# EAGLE design VentilationSystem (EAGLE 7.5.0)
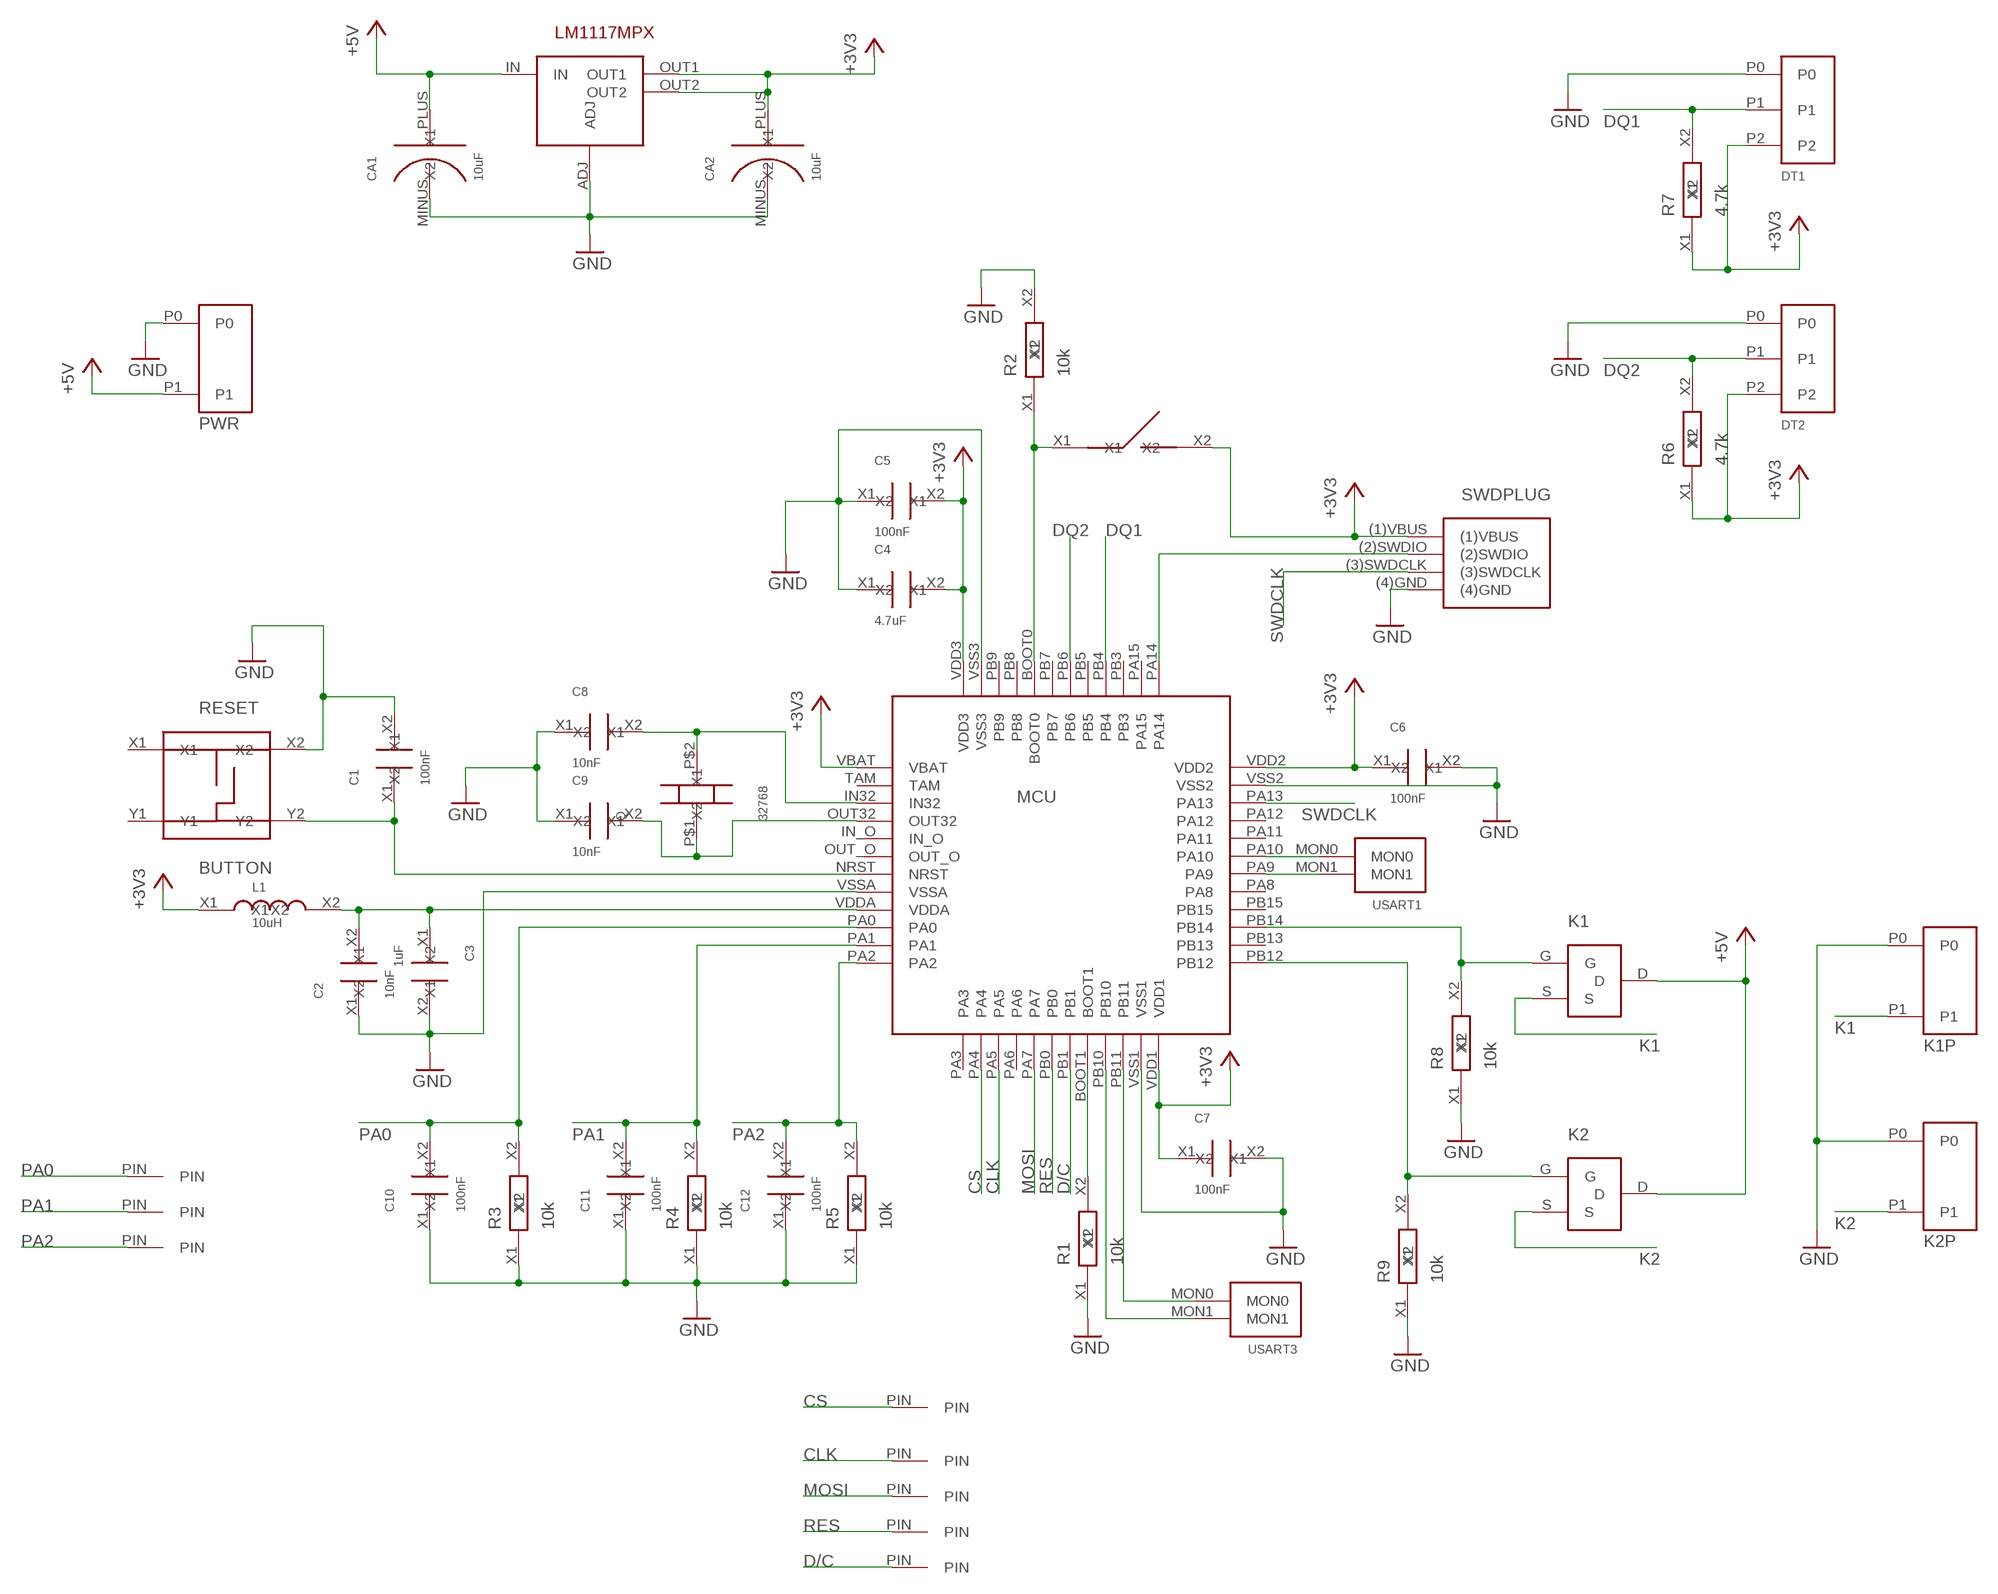
[diagram p0: schematic, sheet 1]

## Parts
C1  100nF  C_SMD_2.1X1.25  [SMD_2.1X1.25]
C2  10nF  C_SMD_2.1X1.25  [SMD_2.1X1.25]
C3  1uF  C_SMD_2.1X1.25  [SMD_2.1X1.25]
C4  4.7uF  C_SMD_2.1X1.25  [SMD_2.1X1.25]
C5  100nF  C_SMD_2.1X1.25  [SMD_2.1X1.25]
C6  100nF  C_SMD_2.1X1.25  [SMD_2.1X1.25]
C7  100nF  C_SMD_2.1X1.25  [SMD_2.1X1.25]
C8  10nF  C_SMD_2.1X1.25  [SMD_2.1X1.25]
C9  10nF  C_SMD_2.1X1.25  [SMD_2.1X1.25]
C10  100nF  C_SMD_2.1X1.25  [SMD_2.1X1.25]
C11  100nF  C_SMD_2.1X1.25  [SMD_2.1X1.25]
C12  100nF  C_SMD_2.1X1.25  [SMD_2.1X1.25]
CA1  10uF  C_SMD_TA_A  [C_SMD_TA_A]
CA2  10uF  C_SMD_TA_A  [C_SMD_TA_A]
CLKPIN  PIN_1  [PIN_1]
CSPIN  PIN_1  [PIN_1]
D/CPIN  PIN_1  [PIN_1]
DT1  RAIL_3  [RAIL_3]
DT2  RAIL_3  [RAIL_3]
K1  IRFML8244TRPBF  [IRFML8244TRPBF]
K1P  RAIL_2  [RAIL_2]
K2  IRFML8244TRPBF  [IRFML8244TRPBF]
K2P  RAIL_2  [RAIL_2]
L1  10uH  L_SMD_2.1X1.25  [SMD_2.1X1.25]
MCU  STM32F103CBT6  [STM32F103CBT6]
MOSIPIN  PIN_1  [PIN_1]
PA0PIN  PIN_1  [PIN_1]
PA1PIN  PIN_1  [PIN_1]
PA2PIN  PIN_1  [PIN_1]
PWR  RAIL_2  [RAIL_2]
Q  32768  QUARTZ_CYL  [QUARTZ_CYL]
R1  10k  R_SMD_2.1X1.25  [SMD_2.1X1.25]
R2  10k  R_SMD_2.1X1.25  [SMD_2.1X1.25]
R3  10k  R_SMD_2.1X1.25  [SMD_2.1X1.25]
R4  10k  R_SMD_2.1X1.25  [SMD_2.1X1.25]
R5  10k  R_SMD_2.1X1.25  [SMD_2.1X1.25]
R6  4.7k  R_SMD_2.1X1.25  [SMD_2.1X1.25]
R7  4.7k  R_SMD_2.1X1.25  [SMD_2.1X1.25]
R8  10k  R_SMD_2.1X1.25  [SMD_2.1X1.25]
R9  10k  R_SMD_2.1X1.25  [SMD_2.1X1.25]
RESET  BUTTON  [BUTTON]
RESPIN  PIN_1  [PIN_1]
SWDPLUG  SWD  [SWD]
U$3  DIP_1  [DIP_1]
U$4  LM1117MPX-ADJ  [LM1117MPX-ADJ]
USART1  MON2PIN  [MON2PIN]
USART3  MON2PIN  [MON2PIN]

## Nets
+3V3: C4.X2 C5.X2 C6.X1 C7.X1 CA2.PLUS(X2) DT1.P2 DT2.P2 L1.X1 MCU.VBAT MCU.VDD1 MCU.VDD2 MCU.VDD3 R6.X1 R7.X1 SWDPLUG.(1)VBUS U$3.X2 U$4.OUT1 U$4.OUT2
+5V: CA1.PLUS(X2) K1.D K2.D PWR.P1 U$4.IN
CLK: CLKPIN.PIN MCU.PA5
CS: CSPIN.PIN MCU.PA4
D/C: D/CPIN.PIN MCU.PB1
DQ1: DT1.P1 MCU.PB4 R7.X2
DQ2: DT2.P1 MCU.PB6 R6.X2
GND: C1.X2 C2.X1 C3.X2 C4.X1 C5.X1 C6.X2 C7.X2 C8.X1 C9.X1 C10.X1 C11.X1 C12.X1 CA1.MINUS(X1) CA2.MINUS(X1) DT1.P0 DT2.P0 K1P.P0 K2P.P0 MCU.VSS1 MCU.VSS2 MCU.VSS3 MCU.VSSA PWR.P0 R1.X1 R2.X2 R3.X1 R4.X1 R5.X1 R8.X1 R9.X1 RESET.X2 SWDPLUG.(4)GND U$4.ADJ
K1: K1.S K1P.P1
K2: K2.S K2P.P1
MOSI: MCU.PA7 MOSIPIN.PIN
N$1: C2.X2 C3.X1 L1.X2 MCU.VDDA
N$2: MCU.BOOT0 R2.X1 U$3.X1
N$3: MCU.BOOT1 R1.X2
N$4: C1.X1 MCU.NRST RESET.Y2
N$5: MCU.PA10 USART1.MON0
N$6: MCU.PA14 SWDPLUG.(2)SWDIO
N$7: MCU.PA9 USART1.MON1
N$8: C9.X2 MCU.OUT32 Q.P$1(X1)
N$9: C8.X2 MCU.IN32 Q.P$2(X2)
N$10: K1.G MCU.PB14 R8.X2
N$11: K2.G MCU.PB12 R9.X2
N$12: MCU.PB11 USART3.MON0
N$13: MCU.PB10 USART3.MON1
PA0: C10.X2 MCU.PA0 PA0PIN.PIN R3.X2
PA1: C11.X2 MCU.PA1 PA1PIN.PIN R4.X2
PA2: C12.X2 MCU.PA2 PA2PIN.PIN R5.X2
RES: MCU.PB0 RESPIN.PIN
SWDCLK: MCU.PA13 SWDPLUG.(3)SWDCLK
Unconnected: MCU.IN_O MCU.OUT_O MCU.PA3 MCU.PA6 MCU.PA8 MCU.PA11 MCU.PA12 MCU.PA15 MCU.PB3 MCU.PB5 MCU.PB7 MCU.PB8 MCU.PB9 MCU.PB13 MCU.PB15 MCU.TAM RESET.X1 RESET.Y1

## Library data of the parts
C1-C12 = MyPowerComponents:C_SMD_2.1X1.25
CA1 CA2 = MyAmSys:C_SMD_TA_A
CLKPIN CSPIN D/CPIN MOSIPIN PA0PIN PA1PIN PA2PIN RESPIN = My_BLE:PIN_1
DT1 DT2 = My_HV_Components:RAIL_3
K1 K2 = My_STM32:IRFML8244TRPBF
K1P K2P PWR = My_HV_Components:RAIL_2
L1 = MyPowerComponents:L_SMD_2.1X1.25
MCU = My_STM32:STM32F103CBT6
Q = MySTM32F103RGT6:QUARTZ_CYL
R1-R9 = MyPowerComponents:R_SMD_2.1X1.25
RESET = My_STM32:BUTTON
SWDPLUG = MyCMOSsensor:SWD
U$3 = My_STM32L15x:DIP_1
U$4 = My_OPT:LM1117MPX-ADJ
USART1 USART3 = MyCMOSsensor:MON2PIN

## Board
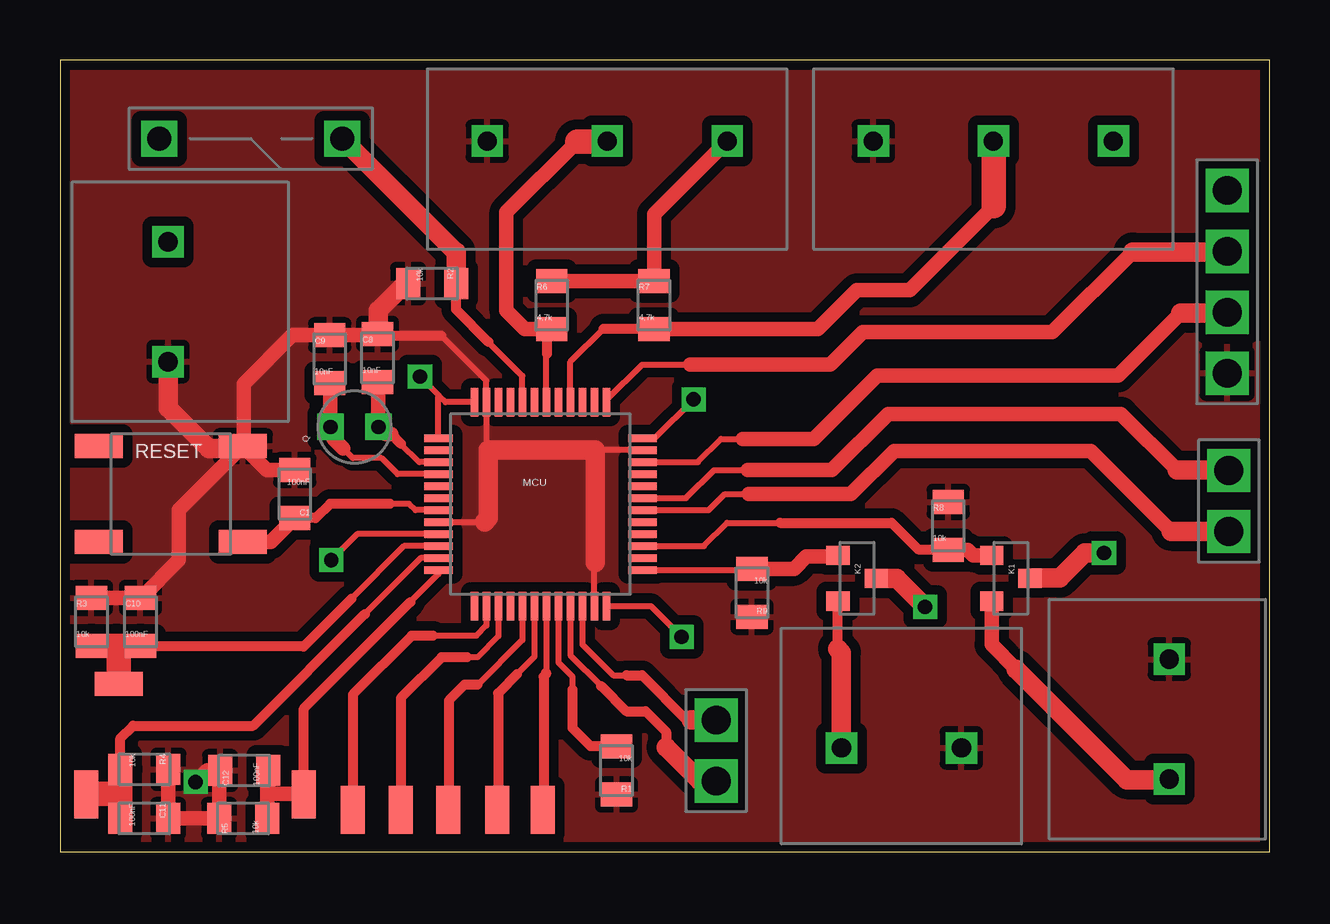
[diagram p1: board, top side]
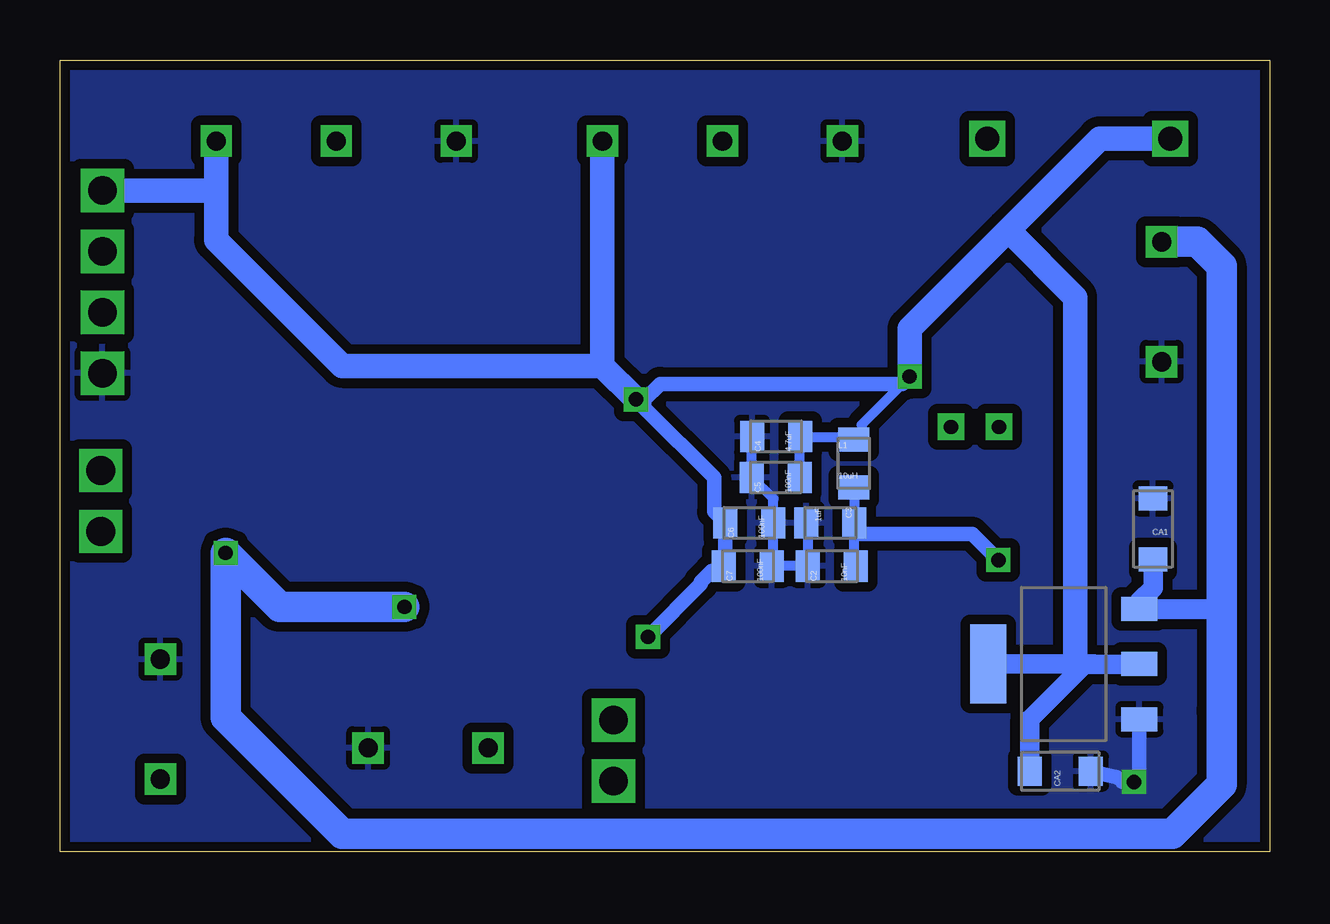
[diagram p2: board, bottom side, seen from below]

Size 50.4 x 33 mm. Coordinates in mm from the lower left corner, seen from the top.
Outline: 0,0 50.4,0 50.4,33 0,33 0,0
Copper layers (1*16): Top 0.035mm / dielectric 1.5mm / Bottom 0.035mm
Design rules "default *": minimum track width 10mil, minimum drill 24mil, track to track 8mil, track to pad 8mil, pad to pad 8mil, via to via 8mil, smd to smd 8mil, copper to edge 10mil, drill to drill 8mil, minimum pad ring 10mil, minimum via ring 8mil, stop-mask expansion 4mil, vias tented up to drill 0mil, thermal gap 10mil

### Footprints (pad centres in the part's own frame; a part is rotated, then mirrored left to right if it is on the bottom)
SMD_2.1X1.25 = smd 1.3 x 1: X1 0,1; X2 0,-1
C_SMD_TA_A = smd 1.2 x 1: MINUS 0,-1.27; PLUS 0,1.27
PIN_1 = smd 2 x 1: PIN 0,0
RAIL_3 = drill 0.8 square: P0 0,5; P1 0,0; P2 0,-5
IRFML8244TRPBF = smd 0.802 x 0.972: D 0,0.8; G -0.95,-0.8; S 0.95,-0.8
RAIL_2 = drill 0.8 square: P0 0,2.5; P1 0,-2.5
STM32F103CBT6 = smd 0.3 x 1.2: BOOT0 -0.75,4.25; BOOT1 0.75,-4.25; PA3 -2.75,-4.25; PA4 -2.25,-4.25; PA5 -1.75,-4.25; PA6 -1.25,-4.25; PA7 -0.75,-4.25; PA14 2.75,4.25; PA15 2.25,4.25; PB0 -0.25,-4.25; PB1 0.25,-4.25; PB3 1.75,4.25; PB4 1.25,4.25; PB5 0.75,4.25; PB6 0.25,4.25; PB7 -0.25,4.25; PB8 -1.25,4.25; PB9 -1.75,4.25; PB10 1.25,-4.25; PB11 1.75,-4.25; VDD1 2.75,-4.25; VDD3 -2.75,4.25; VSS1 2.25,-4.25; VSS3 -2.25,4.25 | smd 1.2 x 0.3: IN32 -4.25,1.75; IN_O -4.25,0.75; NRST -4.25,-0.25; OUT32 -4.25,1.25; OUT_O -4.25,0.25; PA0 -4.25,-1.75; PA1 -4.25,-2.25; PA2 -4.25,-2.75; PA8 4.25,-0.75; PA9 4.25,-0.25; PA10 4.25,0.25; PA11 4.25,0.75; PA12 4.25,1.25; PA13 4.25,1.75; PB12 4.25,-2.75; PB13 4.25,-2.25; PB14 4.25,-1.75; PB15 4.25,-1.25; TAM -4.25,2.25; VBAT -4.25,2.75; VDD2 4.25,2.75; VDDA -4.25,-1.25; VSS2 4.25,2.25; VSSA -4.25,-0.75
QUARTZ_CYL = drill 0.6 square: P$1 0,1; P$2 0,-1
BUTTON = smd 2 x 1: X1 -3,2; X2 3,2; Y1 -3,-2; Y2 3,-2
SWD = drill 1.2 square: (1)VBUS 0,5.08; (2)SWDIO 0,2.54; (3)SWDCLK 0,0; (4)GND 0,-2.54
DIP_1 = drill 1 square: X1 0,2.54; X2 0,-5.08
LM1117MPX-ADJ = smd 1 x 1.5: ADJ -2.3,-6.3; IN 2.3,-6.3; OUT1 0,-6.3 | smd 3.3 x 1.5: OUT2 0,0
MON2PIN = drill 1.2 square: MON0 0,2.54; MON1 0,0

### Placement (x,y rotation side)
C1  9.78,14.9 180 top
C2  18.24,11.9 90 bottom
C3  18.3,13.7 270 bottom
C4  20.56,17.3 90 bottom
C5  20.57,15.6 90 bottom
C6  21.68,13.7 90 bottom
C7  21.74,11.9 90 bottom
C8  13.23,20.58 0 top
C9  11.24,20.53 0 top
C10  3.35,9.58 0 top
C11  3.51,1.38 270 top
C12  7.67,3.38 90 top
CA1  4.86,13.45 180 bottom
CA2  8.72,3.35 90 bottom
CLKPIN  14.2,1.74 90 top
CSPIN  12.2,1.75 90 top
D/CPIN  20.12,1.74 90 top
DT1  38.89,29.62 90 top
DT2  22.8,29.62 90 top
K1  39.62,11.39 270 top
K1P  46.22,5.52 0 top
K2  33.21,11.39 270 top
K2P  35.06,4.32 270 top
L1  17.33,16.18 0 bottom
MCU  20.02,14.48 0 top
MOSIPIN  16.18,1.74 90 top
PA0PIN  2.44,6.99 0 top
PA1PIN  1.1,2.39 90 top
PA2PIN  10.16,2.39 90 top
PWR  4.5,22.92 180 top
Q  12.27,17.7 90 top
R1  23.19,3.38 180 top
R2  15.5,23.68 270 top
R3  1.31,9.58 0 top
R4  3.52,3.43 270 top
R5  7.63,1.38 90 top
R6  20.49,22.78 0 top
R7  24.75,22.78 0 top
R8  37.01,13.58 0 top
R9  28.83,10.79 180 top
RESET  4.62,14.9 0 top
RESPIN  18.22,1.74 90 top
SWDPLUG  48.63,22.48 0 top
U$3  9.22,29.72 270 top
U$4  11.73,7.82 90 bottom
USART1  48.7,13.34 0 top
USART3  27.34,2.94 0 top

### Tracks (layer width: path | path; a pad name or v marks a point on that pad's centre or on a via)
+3V3  (via drill 0.6)
  Top 0.254: MCU.VDD3 16.07,18.73 15.8,19 | 15.8,19 v15,19.8 | MCU.VBAT 15.77,18.97 15.8,19 | MCU.VDD2 24.78,17.23 v26.4,18.85 | MCU.VDD1 24.62,10.23 v25.9,8.95
  Top 0.61: R6.X1 R7.X1 24.75,26.57 DT2.P2
  Bottom 0.406: C5.X2 C4.X2 | C4.X2 | C4.X2 17.44,17.29 L1.X1 17,17.51 17,17.8 v15,19.8
  Bottom 0.61: v26.4,18.85 26.05,18.5 | 26.05,18.5 23.15,15.6 23.15,14.17 C6.X1 22.68,11.96 C7.X1 22.94,11.7 23.25,11.7 23.7,11.25 23.7,11.15 v25.9,8.95 | 26.05,18.5 26.05,18.85 25.4,19.5 15.3,19.5 v15,19.8
  Bottom 0.813: CA2.PLUS 9.99,5.51 7.7,7.8 7.3,7.8 | 7.3,7.8 5.45,7.8 U$4.OUT1 | 7.3,7.8 7.32,7.82 U$4.OUT2 8.17,7.82 8.1,7.75
  Bottom 1.016: v15,19.8 15,21.8 10.9,25.9 | DT2.P2 27.8,20.25 | 27.8,20.25 v26.4,18.85 | DT1.P2 43.89,27.5 | 43.89,27.5 43.89,25.49 38.65,20.25 27.8,20.25 | SWDPLUG.(1)VBUS 43.95,27.56 43.89,27.5 | 8.1,7.75 8.1,23.1 10.9,25.9 | U$3.X2 7.08,29.72 10.9,25.9
+5V  (via drill 0.6)
  Top 0.813: v43.5,12.45 42.7,12.45 41.65,11.4 K1.D | K2.D 34.86,11.39 v36.05,10.2
  Bottom 0.61: 5.43,10.18 5.35,10.1
  Bottom 0.813: 5.43,10.18 U$4.IN 2.03,10.12 2,10.15 | 5.43,10.18 5.43,10.42 4.85,11 CA1.PLUS | 5.43,10.18 4.98,10.18 4.9,10.1 2,10.1 2,5.85
  Bottom 1.27: 2,5.9 2,10.1 2,10.15 2,24.4 3.02,25.42 PWR.P1 | 2,5.85 2,2.8 4.05,0.75 38.65,0.75 43.5,5.6 v43.5,12.45 41.25,10.2 v36.05,10.2
CLK
  Top 0.254: MCU.PA5 18.27,8.97 17.4,8.1 16.95,8.1
  Top 0.406: 16.95,8.1 15.9,8.1 14.2,6.4 CLKPIN.PIN
CS
  Top 0.254: MCU.PA4 17.77,9.42 17.35,9 15.55,9
  Top 0.406: 15.55,9 14.65,9 12.2,6.55 CSPIN.PIN
D/C
  Top 0.254: MCU.PB1 20.27,7.47 20.25,7.45
  Top 0.406: 20.25,7.45 20.25,7.4 20.15,7.3 20.15,2.42 D/CPIN.PIN
DQ1
  Top 0.254: MCU.PB4 21.27,20.42 22.65,21.8
  Top 0.406: 22.65,21.8 24.73,21.8 R7.X2
  Top 0.61: R7.X2 31.58,21.78 33.2,23.4 35.4,23.4 38.9,26.9
  Top 1.016: 38.9,26.9 DT1.P1
DQ2
  Top 0.254: MCU.PB6 20.27,20.72 20.3,20.75
  Top 0.406: 20.3,20.75 20.3,21.59 R6.X2
  Top 0.61: R6.X2 19.37,21.78 18.6,22.55 18.6,26.65 21.55,29.6
  Top 1.016: 21.55,29.6 22.78,29.6 DT2.P1
GND  (via drill 0.6)
  Top 0.254: MCU.VSSA 17.68,13.73 17.7,13.75 | 17.85,16.75 17.77,16.83 MCU.VSS3 17.77,19.63 15.9,21.5 | MCU.VSS2 22.32,16.73 22.3,16.75 | MCU.VSS1 22.27,12.02 22.3,12.05
  Top 0.406: 15.9,21.5 13.31,21.5 C8.X1
  Top 0.61: R4.X1 C11.X1 R5.X1 6.63,3.34 C12.X1 6.13,3.38 v5.65,2.9 | R3.X1 C10.X1 3.38,10.58 4.95,12.15 4.95,14.23 RESET.X2 | C1.X2 8.62,15.9 RESET.X2 | C8.X1 13.18,21.53 C9.X1 9.68,21.53 7.65,19.5 7.65,16.93 RESET.X2
  Top 0.813: PWR.P0 4.5,18.5 6.2,16.8 7.52,16.8 RESET.X2 | 17.7,13.75 17.85,13.9 17.85,16.75 22.3,16.75 22.3,12.05 | R2.X2 14.38,23.68 13.25,22.55 13.25,21.6 C8.X1
  Bottom 0.406: C3.X2 19.24,13.7 C2.X1 C7.X2 20.68,11.9 C6.X2 20.68,14.71 C5.X1 C4.X1
  Bottom 0.61: CA2.MINUS 6.35,3.1 6.15,2.9 v5.65,2.9 5.43,3.12 U$4.ADJ
  pour Bottom (isolate 0.406): 0,0 50.4,0 50.4,33 0,33
  pour Top (isolate 0.406): 0,0 50.4,0 50.4,33 0,33
K1
  Top 0.61: K1.S 38.82,8.63 39.85,7.6
  Top 0.813: 39.85,7.6 44.45,3 46.2,3 K1P.P1
K2
  Top 0.406: 32.4,8.45 K2.S
  Top 0.813: K2P.P1 32.56,8.29 32.4,8.45
MOSI
  Top 0.254: MCU.PA7 19.27,8.82 17.4,6.95
  Top 0.406: 17.4,6.95 16.85,6.95 16.2,6.3 16.2,2.41 MOSIPIN.PIN
N$1  (via drill 0.6)
  Top 0.254: MCU.VDDA 12.38,13.23 v11.3,12.15
  Bottom 0.406: L1.X2 17.3,15.18 C3.X1 17.3,13.2 17.3,11.9 C2.X2
  Bottom 0.61: v11.3,12.15 12.4,13.25 17.25,13.25 17.3,13.2
N$2
  Top 0.254: MCU.BOOT0 19.27,19.83 17.85,21.25
  Top 0.406: 17.85,21.25 16.5,22.6 R2.X1
  Top 0.813: R2.X1 16.5,25 16.48,25 U$3.X1
N$3
  Top 0.254: MCU.BOOT1 20.77,7.88 21.35,7.3 21.35,6.75
  Top 0.406: 21.35,6.75 21.35,5.15 22.1,4.4 23.17,4.4 R1.X2
N$4
  Top 0.254: MCU.NRST 14.82,14.23 14.55,14.5 13.75,14.5
  Top 0.406: 13.75,14.5 11.25,14.5 10.65,13.9 C1.X1
  Top 0.61: RESET.Y2 8.78,12.9 C1.X1
N$5
  Top 0.254: MCU.PA10 26.08,14.73 27.25,15.9 28.65,15.9
  Top 0.61: 28.65,15.9 32.15,15.9 34.5,18.25 44.2,18.25 46.55,15.9
  Top 0.813: 46.55,15.9 48.68,15.9 USART1.MON0
N$6
  Top 0.254: MCU.PA14 22.77,18.82 24.25,20.3 26.25,20.3
  Top 0.61: 26.25,20.3 32.1,20.3 33.45,21.65 41.35,21.65 44.7,25
  Top 0.813: 44.7,25 48.61,25 SWDPLUG.(2)SWDIO
N$7
  Top 0.254: MCU.PA9 27.03,14.23 27.7,14.9 28.7,14.9
  Top 0.61: 28.7,14.9 32.95,14.9 34.75,16.7 42.95,16.7 46.3,13.35
  Top 0.813: 46.3,13.35 USART1.MON1
N$8
  Top 0.254: MCU.OUT32 14.07,15.73 13.4,16.4 12.2,16.4 11.8,16.8
  Top 0.61: 11.8,16.8 11.4,17.2 11.4,17.57 Q.P$1 11.27,19.5 C9.X2
N$9
  Top 0.254: MCU.IN32 14.97,16.23 14.2,17
  Top 0.406: 14.2,17 13.8,17.4
  Top 0.61: 13.8,17.4 13.57,17.4 Q.P$2 13.27,19.54 C8.X2
N$10
  Top 0.254: MCU.PB14 26.83,12.73 27.8,13.7 30,13.7
  Top 0.406: 30,13.7 34.65,13.7 35.75,12.6 36.99,12.6 R8.X2
  Top 0.61: R8.X2 37.82,12.58 38.05,12.35 K1.G
N$11
  Top 0.254: MCU.PB12 28.77,11.73 R9.X2
  Top 0.61: R9.X2 30.59,11.79 31.1,12.3 32.37,12.3 K2.G
N$12
  Top 0.254: MCU.PB11 21.77,8.63 23.05,7.35 23.6,7.35
  Top 0.406: 23.6,7.35 24.25,7.35 26.1,5.5 26.3,5.5
  Top 0.813: 26.3,5.5 27.32,5.5 USART3.MON0
N$13
  Top 0.254: MCU.PB10 21.27,8.18 22.55,6.9
  Top 0.406: 22.55,6.9 23.6,5.85 24.4,5.85 25.25,5 25.25,4.35
  Top 0.813: USART3.MON1 26.66,2.94 25.25,4.35
PA0
  Top 0.254: MCU.PA0 14.33,12.73 12.15,10.55
  Top 0.406: 12.15,10.55 10.15,8.55 3.38,8.55 C10.X2
  Top 1.016: R3.X2 2.35,8.58 | 2.35,8.58 C10.X2 | PA0PIN.PIN 2.44,8.49 2.35,8.58
PA1
  Top 0.254: MCU.PA1 15.03,12.23 12.7,9.9
  Top 0.406: R4.X2 2.52,4.72 3.05,5.25 8.05,5.25 12.7,9.9
  Top 1.016: R4.X2 C11.X2 2.51,2.39 2.5,2.4 PA1PIN.PIN
PA2
  Top 0.254: MCU.PA2 15.77,11.57 14.6,10.4
  Top 0.406: PA2PIN.PIN 10.16,5.96 14.6,10.4
  Top 0.61: R5.X2 8.63,3.34 C12.X2 8.67,2.43 8.7,2.4 PA2PIN.PIN
RES
  Top 0.254: MCU.PB0 19.77,8.12 19.05,7.4
  Top 0.406: 19.05,7.4 18.25,6.6 18.25,2.42 RESPIN.PIN
SWDCLK
  Top 0.254: MCU.PA13 26.58,16.23 27.55,17.2 28.45,17.2
  Top 0.61: 28.45,17.2 31.4,17.2 34.05,19.85 44.1,19.85 46.7,22.45
  Top 0.813: 46.7,22.45 48.6,22.45 SWDPLUG.(3)SWDCLK